# Altium schematic sheet mar6_sch.SchDoc
size A4; Organization1: VINCULADA AO EXÉRCITO BRASILEIRO; Organization2: FÁBRICA DE MATERIAL DE; Organization3: COMUNICAÇÕES E ELETRÔNICA; Organization0: INDÚSTRIA DE MATERIAL BÉLICO DO BRASIL; Esquematico: Esquemático
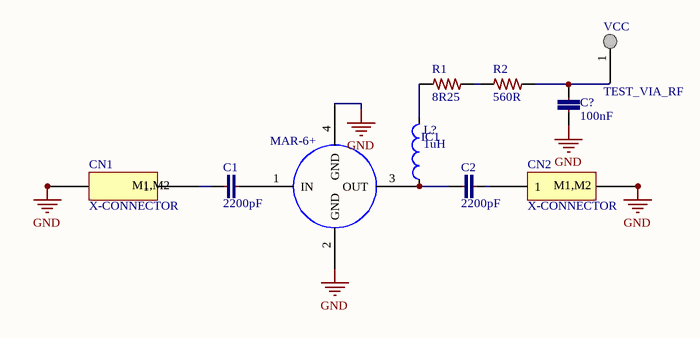
[diagram p0: mar6_sch.SchDoc]

## Parts
C1  2200pF  [CAPC0603(1608)55_L]
C2  2200pF  [CAPC0603(1608)55_L]
C?  100nF  [0402-CAP]
CN1  X-CONNECTOR  [X-CONNECTOR-PCB]
CN2  X-CONNECTOR  [X-CONNECTOR-PCB]
IC1  MAR-6+  [New footprint 1]
L?  1uH  [0603-IND]
R1  8R25  [0402-RES-HD]
R2  560R  [0603-RES-HD]
VCC  TEST_VIA_RF  [New footprint 1]

## Nets
GND: C?.2 CN1.M1 CN1.M2 CN2.M1 CN2.M2 IC1.2(GND) IC1.4(GND)
NetC1_1: C1.1 CN1.1
NetC1_2: C1.2 IC1.1(IN)
NetC2_1: C2.1 IC1.3(OUT) L?.1
NetC2_2: C2.2 CN2.1
NetC?_1: C?.1 R2.2 VCC.1
NetL?_2: L?.2 R1.1
NetR1_2: R1.2 R2.1

## Notes on the sheet
- USADO EQUIP.:
- DATA:
- ENG:
- VERIF:
- HORA:
- REV:
- APROV:
- TÍTULO:
- FOLHA:
- /
- FORMATO:
- A4
- CÓDIGO:
- ESTOQUE:
- (in symbol X-CONNECTOR-5) M1,M2

## Library data of the parts
C1 C2 = C0603-2200pF-1: CAP CER 2200PF 50V NP0 0603; Part No: C0603C222F5GACTU; Cod EMS: 05.281.019.533; Value: 2200pF
C? = CC0402-100nF-A.12: CAP CER 0.1UF 10V 20% X5R 0402; Part No: VJ0402V104ZXQPBC; Cod EMS: 05.281.006.133; Value: 100n
CN1 CN2 = X-CONNECTOR-5: CONECTOR PARA MÓDULOS X MICROWAVE; RoHS: Yes; Mount: TH
IC1 = MAR-6+-01.A.1: Wideband Amplifier 21.8dB typ. at 0.1 GHz low noise figure, 2.3 dB typ.
L? = MLF1608A1R0KTA00-1: Fixed Inductors 1.0 UH 10%; Part No: MLF1608A1R0KTA00
R1 = 8R25 0402-01.A.1: Thick Film Resistors - SMD 1/16watt 8.25ohms 1%
R2 = R0603-560R-1: RES SMD 560 OHM 0.1% 1/10W 0603; Part No: TNPW0603560RBEEA; Family Description: RESISTOR FILME FINO 10R-332K / 1/10W / 0,1% / 25PPM /  0603. P/N: TNPW0603....BEEA – VISHAY DALE.; Family: TNPW0603....BEEA
VCC = TEST_VIA_RF-01.A.1: Test VIA for RF circuits